# EAGLE board canSlaveV03_16s (EAGLE 6.3), part 1 of 2
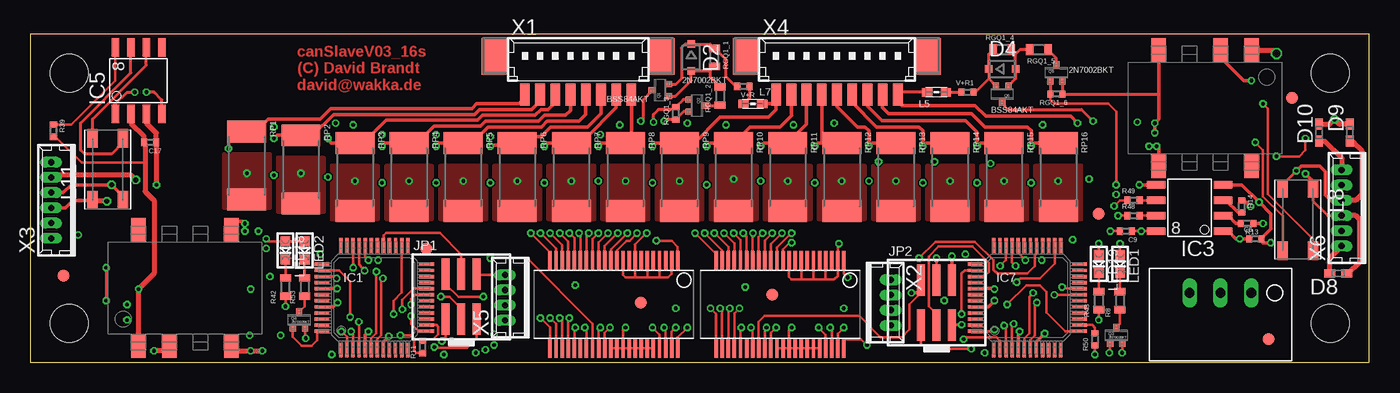
[diagram p6: board, top side]
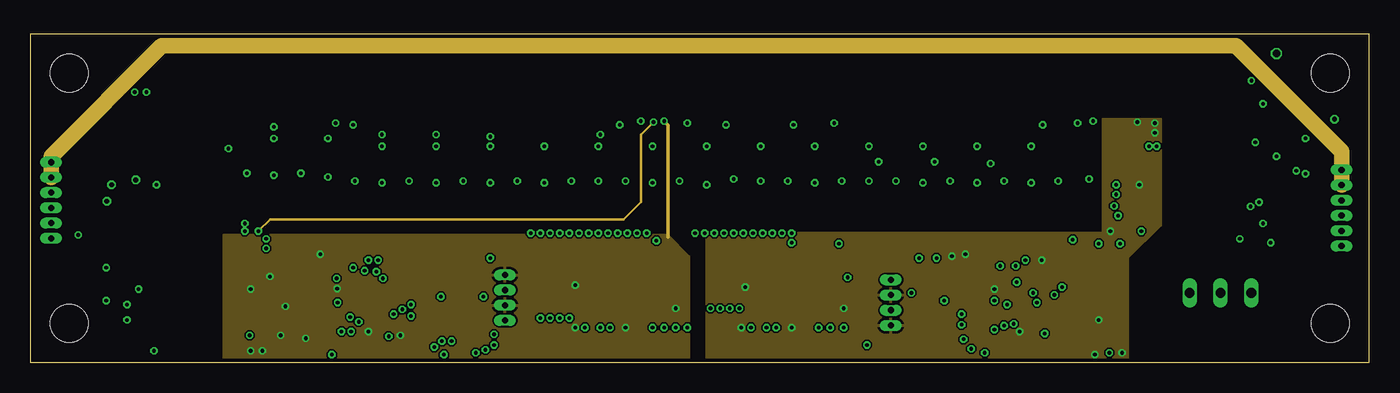
[diagram p7: board, inner layer Route2]
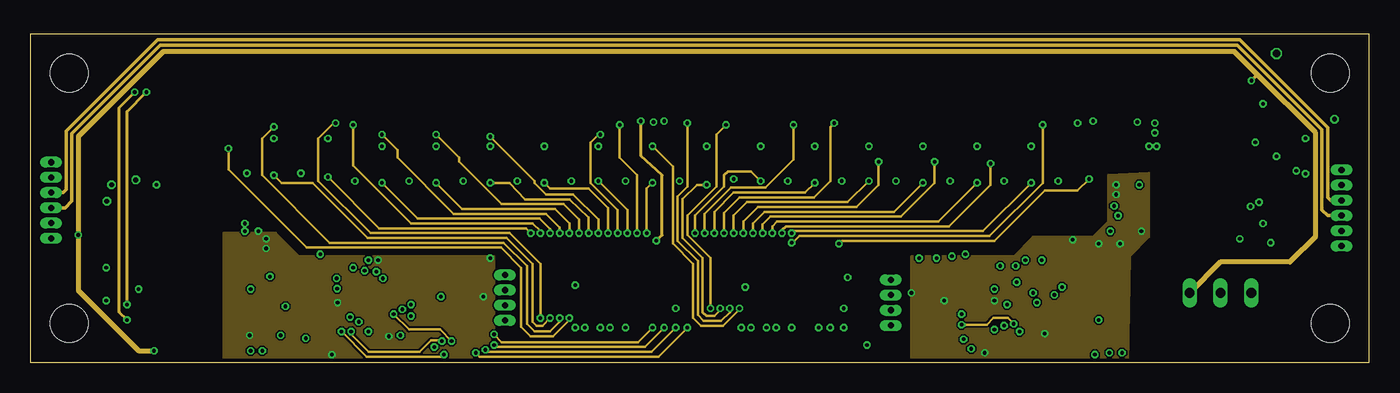
[diagram p8: board, inner layer Route15]
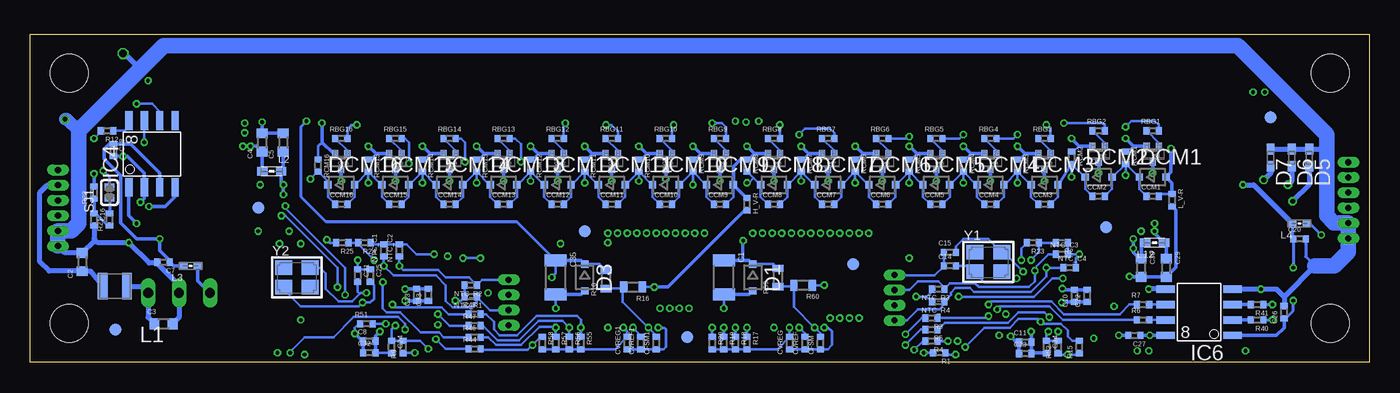
[diagram p9: board, bottom side, seen from below]

Size 110 x 27 mm. Coordinates in mm from the lower left corner, seen from the top.
Outline: 0,0 110,0 110,27 0,27 0,0
Copper layers (1+2*15+16): Top 0.035mm / dielectric 0.38mm / Route2 0.035mm / dielectric 0.71mm / Route15 0.035mm / dielectric 0.38mm / Bottom 0.035mm
Design rules "PCB-POOL Standard_ML4 *": minimum track width 0.15mm, minimum drill 0.3mm, track to track 0.15mm, track to pad 0.15mm, pad to pad 0.15mm, via to via 0.15mm, smd to smd 0.15mm, copper to edge 0.3mm, drill to drill 0.2mm, minimum pad ring 0.2mm, minimum via ring 0.15mm, stop-mask expansion 0.075mm, vias tented up to drill 0.41mm, thermal gap 0.2mm
Holes 3.1 mm at 3.2,3.2 3.2,23.8 106.8,3.2 106.8,23.8
tRestrict: area 0.2,0.2 to 6.2,6.2; area 0.2,20.8 to 6.2,26.8; area 103.8,0.2 to 109.8,6.2; area 103.8,20.8 to 109.8,26.8
bRestrict: area 0.2,0.2 to 6.2,6.2; area 0.2,20.8 to 6.2,26.8; area 103.8,0.2 to 109.8,6.2; area 103.8,20.8 to 109.8,26.8

## Footprints (pad centres in the part's own frame; a part is rotated, then mirrored left to right if it is on the bottom)
C1206 = smd 1 x 1.8: 1 -1.4,0; 2 1.4,0
C0603 = smd 0.8 x 0.9: 1 -0.75,0; 2 0.75,0
C0402 = smd 0.5 x 0.6: 1 -0.5,0; 2 0.5,0
SOD323-R = smd 0.6 x 0.6: A 1.1,0; C -1.1,0
WESURGE_0402 = smd 0.9 x 0.65: 1 -0.7,0; 2 0.7,0
ISF = smd 1.2 x 2: 1 -3.81,-4.75; 2 -1.27,-4.75; 4 3.81,-4.75; 5 3.81,4.75; 8 -3.81,4.75
TSR1 = drill 0.8 long: 1 -2.54,0; 2 0,0; 3 2.54,0
FIDUCIAL_1MM = smd 1 x 1: 1 0,0
R0402 = smd 0.5 x 0.6: 1 -0.5,0; 2 0.5,0
LQFP48 = smd 0.28 x 1.2: 1 -2.75,-4.3; 2 -2.25,-4.3; 3 -1.75,-4.3; 4 -1.25,-4.3; 5 -0.75,-4.3; 6 -0.25,-4.3; 7 0.25,-4.3; 8 0.75,-4.3; 9 1.25,-4.3; 10 1.75,-4.3; 11 2.25,-4.3; 12 2.75,-4.3; 25 2.75,4.3; 26 2.25,4.3; 27 1.75,4.3; 28 1.25,4.3; 29 0.75,4.3; 30 0.25,4.3; 31 -0.25,4.3; 32 -0.75,4.3; 33 -1.25,4.3; 34 -1.75,4.3; 35 -2.25,4.3; 36 -2.75,4.3 | smd 1.2 x 0.28: 13 4.3,-2.75; 14 4.3,-2.25; 15 4.3,-1.75; 16 4.3,-1.25; 17 4.3,-0.75; 18 4.3,-0.25; 19 4.3,0.25; 20 4.3,0.75; 21 4.3,1.25; 22 4.3,1.75; 23 4.3,2.25; 24 4.3,2.75; 37 -4.3,2.75; 38 -4.3,2.25; 39 -4.3,1.75; 40 -4.3,1.25; 41 -4.3,0.75; 42 -4.3,0.25; 43 -4.3,-0.25; 44 -4.3,-0.75; 45 -4.3,-1.25; 46 -4.3,-1.75; 47 -4.3,-2.25; 48 -4.3,-2.75
44SSOP = smd 1.6 x 0.28: 1 -3.6,5.25; 2 -3.6,4.75; 3 -3.6,4.25; 4 -3.6,3.75; 5 -3.6,3.25; 6 -3.6,2.75; 7 -3.6,2.25; 8 -3.6,1.75; 9 -3.6,1.25; 10 -3.6,0.75; 11 -3.6,0.25; 12 -3.6,-0.25; 13 -3.6,-0.75; 14 -3.6,-1.25; 15 -3.6,-1.75; 16 -3.6,-2.25; 17 -3.6,-2.75; 18 -3.6,-3.25; 19 -3.6,-3.75; 20 -3.6,-4.25; 21 -3.6,-4.75; 22 -3.6,-5.25; 23 3.6,-5.25; 24 3.6,-4.75; 25 3.6,-4.25; 26 3.6,-3.75; 27 3.6,-3.25; 28 3.6,-2.75; 29 3.6,-2.25; 30 3.6,-1.75; 31 3.6,-1.25; 32 3.6,-0.75; 33 3.6,-0.25; 34 3.6,0.25; 35 3.6,0.75; 36 3.6,1.25; 37 3.6,1.75; 38 3.6,2.25; 39 3.6,2.75; 40 3.6,3.25; 41 3.6,3.75; 42 3.6,4.25; 43 3.6,4.75; 44 3.6,5.25
SO-8 = smd 1.524 x 0.61: 1 -2.743,1.905; 2 -2.743,0.635; 3 -2.743,-0.635; 4 -2.743,-1.905; 5 2.743,-1.905; 6 2.743,-0.635; 7 2.743,0.635; 8 2.743,1.905
2X03_1.27MM_SMT = smd 0.65 x 2.6: 1 -1.27,-1.85; 2 -1.27,1.85; 3 0,-1.85; 4 0,1.85; 5 1.27,-1.85; 6 1.27,1.85
WE-PMI_1008 = smd 0.8 x 2.2: 1 -1,0; 2 1,0
0603 = smd 0.85 x 0.7: 1 -0.775,0; 2 0.775,0
0402 = smd 0.7 x 0.6: 1 -0.6,0; 2 0.6,0
WE-SL1 = smd 1.5 x 0.85: 1 -2.55,-1.25; 3 -2.55,1.25; 4 2.55,1.25; 5 2.55,-1.25
CHIPLED_0603 = smd 0.8 x 0.8: A 0,-0.75; C 0,0.75
SOT416 = smd 0.5 x 0.6: 1 -0.5,-0.65; 2 0.5,-0.65; 3 0,0.65
R0603 = smd 0.6 x 0.9: 1 -0.75,0; 2 0.75,0
R2512 = smd 1.8 x 3.2: 1 -2.8,0; 2 2.8,0
SOLDERJUMPER_REFLOW_NOPASTE_SMALL = smd 0.584 x 0.762: 1 -0.445,0; 2 0.445,0
53398-08 = smd 0.8 x 1.8: 1 4.375,-2.5; 2 3.125,-2.5; 3 1.875,-2.5; 4 0.625,-2.5; 5 -0.625,-2.5; 6 -1.875,-2.5; 7 -3.125,-2.5; 8 -4.375,-2.5 | smd 2.1 x 3: S1 6.875,0.625; S2 -6.875,0.625
53047-04 = drill 0.5 pad 0.698 long: 1 1.875,0.45; 2 0.625,0.45; 3 -0.625,0.45; 4 -1.875,0.45
53047-06 = drill 0.5 pad 0.698 long: 1 3.125,0.45; 2 1.875,0.45; 3 0.625,0.45; 4 -0.625,0.45; 5 -1.875,0.45; 6 -3.125,0.45
53398-09 = smd 0.8 x 1.8: 1 5,-2.5; 2 3.75,-2.5; 3 2.5,-2.5; 4 1.25,-2.5; 5 0,-2.5; 6 -1.25,-2.5; 7 -2.5,-2.5; 8 -3.75,-2.5; 9 -5,-2.5 | smd 2.1 x 3: S1 7.5,0.625; S2 -7.5,0.625
CRYSTAL_3.2X2.5 = smd 1.4 x 1.2: 1 -1.1,-0.8; 2 1.1,0.8; GND1 -1.1,0.8; GND2 1.1,-0.8

## Placement (x,y rotation side)
C1  10u,50V  [C1206]  53.02,6.99 270 bottom
C2  10u,50V  [C0603]  105.73,8.26 90 bottom
C3  10u,50V  [C0603]  99.06,3.17 0 bottom
C4  10u,50V  [C0603]  90.96,18.1 90 bottom
C5  10u,50V  [C0603]  89.22,18.1 90 bottom
C6  100n  [C0402]  100.65,10.16 0 top
C7  1u  [C0402]  99.06,8.26 180 bottom
C8  10n  [C0402]  82.15,1.75 0 bottom
C9  100n  [C0402]  90.01,10.79 180 top
C10  10n  [C0402]  24.21,5.48 90 bottom
C11  10n  [C0402]  28.26,1.67 0 bottom
C13  10n  [C0402]  78.26,5.56 90 bottom
C14  18p  [C0402]  34.45,7.94 0 bottom
C15  18p  [C0402]  34.45,9.05 0 bottom
C16  4.7n  [C0402]  104.78,11.75 270 bottom
C17  100n  [C0402]  9.84,18.1 180 top
C18  100n  [C0402]  103.19,17.46 270 bottom
C20  1u  [C0402]  5.71,10.16 0 bottom
C22  100n  [C0402]  23.18,5.48 90 bottom
C23  100n  [C0402]  28.26,0.71 0 bottom
C24  100n  [C0402]  80.33,1.27 270 bottom
C25  18p  [C0402]  82.07,7.14 270 bottom
C26  100n  [C0402]  6.99,4.13 90 bottom
C27  100n  [C0402]  19.29,2.22 180 bottom
C29  10u,50V  [C0603]  16.67,7.78 270 bottom
C30  10u,50V  [C0603]  18.73,7.78 270 bottom
C31  18p  [C0402]  83.11,7.14 270 bottom
C32  100n  [C0402]  82.15,0.79 0 bottom
C33  100n  [C0402]  77.31,5.56 90 bottom
C34  100n  [C0402]  26.51,1.27 270 bottom
C35  10u,50V  [C1206]  66.83,6.99 270 bottom
CCM1  100n  [C0402]  17.78,13.65 0 bottom
CCM2  100n  [C0402]  22.23,13.65 0 bottom
CCM3  100n  [C0402]  26.67,13.02 0 bottom
CCM4  100n  [C0402]  31.11,13.02 0 bottom
CCM5  100n  [C0402]  35.56,13.02 0 bottom
CCM6  100n  [C0402]  40.01,13.02 0 bottom
CCM7  100n  [C0402]  44.45,13.02 0 bottom
CCM8  100n  [C0402]  48.9,13.02 0 bottom
CCM9  100n  [C0402]  53.34,13.02 0 bottom
CCM10  100n  [C0402]  57.78,13.02 0 bottom
CCM11  100n  [C0402]  62.23,13.02 0 bottom
CCM12  100n  [C0402]  66.67,13.02 0 bottom
CCM13  100n  [C0402]  71.12,13.02 0 bottom
CCM14  100n  [C0402]  75.56,13.02 0 bottom
CCM15  100n  [C0402]  80.01,13.02 0 bottom
CCM16  100n  [C0402]  84.45,13.02 0 bottom
CFSM  1u  [C0402]  45.09,1.59 90 bottom
CFSM1  1u  [C0402]  58.58,1.59 90 bottom
CVREF  1u  [C0402]  46.35,1.59 90 bottom
CVREF1  1u  [C0402]  59.85,1.59 90 bottom
CVREG  1u  [C0402]  47.62,1.59 90 bottom
CVREG1  1u  [C0402]  60.96,1.59 90 bottom
D1  40V  [SOD323-R]  50.64,6.99 270 bottom
D2  12V  [SOD323-R]  54.29,25.08 270 top
D3  40V  [SOD323-R]  64.45,6.99 270 bottom
D4  12V  [SOD323-R]  79.85,24.13 0 top
D5  WE-VE_0402  [WESURGE_0402]  4.92,16.83 90 bottom
D6  WE-VE_0402  [WESURGE_0402]  6.35,16.83 90 bottom
D7  WE-VE_0402  [WESURGE_0402]  8.1,16.83 90 bottom
D8  WE-VE_0402  [WESURGE_0402]  107.47,7.3 0 top
D9  WE-VE_0402  [WESURGE_0402]  108.43,18.89 270 top
D10  WE-VE_0402  [WESURGE_0402]  105.89,18.89 270 top
DCDC1  TES 1-0510  [ISF]  96.52,20.92 180 top
DCDC2  TES 1-0510  [ISF]  12.7,6.11 0 top
DCIN  TSR 1-2450  [TSR1]  97.79,5.71 180 top
DCM1  7.5  [SOD323-R]  17.78,15.24 0 bottom
DCM2  7.5  [SOD323-R]  22.23,15.24 0 bottom
DCM3  7.5  [SOD323-R]  26.67,14.61 0 bottom
DCM4  7.5  [SOD323-R]  31.11,14.61 0 bottom
DCM5  7.5  [SOD323-R]  35.56,14.61 0 bottom
DCM6  7.5  [SOD323-R]  40.01,14.61 0 bottom
DCM7  7.5  [SOD323-R]  44.45,14.61 0 bottom
DCM8  7.5  [SOD323-R]  48.9,14.61 0 bottom
DCM9  7.5  [SOD323-R]  53.34,14.61 0 bottom
DCM10  7.5  [SOD323-R]  57.78,14.61 0 bottom
DCM11  7.5  [SOD323-R]  62.23,14.61 0 bottom
DCM12  7.5  [SOD323-R]  66.67,14.61 0 bottom
DCM13  7.5  [SOD323-R]  71.12,14.61 0 bottom
DCM14  7.5  [SOD323-R]  75.56,14.61 0 bottom
DCM15  7.5  [SOD323-R]  80.01,14.61 0 bottom
DCM16  7.5  [SOD323-R]  84.45,14.61 0 bottom
FID1  FIDUCIAL""  [FIDUCIAL_1MM]  50.16,4.92 0 top
FID2  FIDUCIAL""  [FIDUCIAL_1MM]  60.96,5.56 0 top
FID3  FIDUCIAL""  [FIDUCIAL_1MM]  2.7,7.14 0 top
FID4  FIDUCIAL""  [FIDUCIAL_1MM]  103.66,21.75 0 top
FID5  FIDUCIAL""  [FIDUCIAL_1MM]  101.76,1.91 0 top
FID6  FIDUCIAL""  [FIDUCIAL_1MM]  87.79,12.22 0 top
FID7  FIDUCIAL""  [FIDUCIAL_1MM]  32.54,9.37 0 top
FID8  FIDUCIAL""  [FIDUCIAL_1MM]  91.28,12.7 0 bottom
FID9  FIDUCIAL""  [FIDUCIAL_1MM]  21.59,11.11 0 bottom
FID10  FIDUCIAL""  [FIDUCIAL_1MM]  8.1,20.16 0 bottom
FID11  FIDUCIAL""  [FIDUCIAL_1MM]  42.39,8.1 0 bottom
FID12  FIDUCIAL""  [FIDUCIAL_1MM]  103.03,2.7 0 bottom
FID13  FIDUCIAL""  [FIDUCIAL_1MM]  64.45,10.79 0 bottom
FID14  FIDUCIAL""  [FIDUCIAL_1MM]  56.04,2.06 0 bottom
H_V-R  100  [R0402]  51.12,13.02 270 bottom
IC1  LPC11C1X  [LQFP48]  28.26,5.32 0 top
IC2  LTC6803-4  [44SSOP]  47.94,4.76 270 top
IC3  ADUM1201  [SO-8]  95.25,12.7 180 top
IC4  MCP2551  [SO-8]  100.01,17.14 90 bottom
IC5  MCP2551  [SO-8]  8.89,23.18 90 top
IC6  ADUM1201  [SO-8]  13.97,4.13 180 bottom
IC7  LPC11C1X  [LQFP48]  81.92,5.32 0 top
IC8  LTC6803-4  [44SSOP]  61.59,4.76 270 top
JP1  [2X03_1.27MM_SMT]  35.4,5.4 0 top
JP2  [2X03_1.27MM_SMT]  74.45,4.92 0 top
L1  WE-PMI_1008  [WE-PMI_1008]  103.07,6.27 180 bottom
L2  WE-CBF_0603  [0603]  90.17,15.72 180 bottom
L3  WE-CBF_0402  [0402]  96.84,7.94 0 bottom
L4  WE-CBF_0402  [0402]  5.71,11.43 0 bottom
L5  WE-CBF_0603  [0603]  74.45,22.23 0 top
L7  WE-CBF_0603  [0603]  59.37,21.27 180 top
L8  744212820  [WE-SL1]  104.14,11.75 270 top
L11  744212820  [WE-SL1]  6.35,15.88 90 top
L12  WE-CBF_0603  [0603]  17.62,9.84 0 bottom
L_V-R  100  [R0402]  16.19,13.34 270 bottom
LED1  O  [CHIPLED_0603]  89.53,8.1 180 top
LED2  O  [CHIPLED_0603]  22.54,9.21 180 top
LED18  G  [CHIPLED_0603]  20.95,9.21 180 top
LED19  G  [CHIPLED_0603]  87.79,8.1 180 top
NTC_C1  100n  [C0402]  80.96,9.21 90 bottom
NTC_C2  100n  [C0402]  79.69,9.21 90 bottom
NTC_C3  100n  [C0402]  25.24,8.89 0 bottom
NTC_C4  100n  [C0402]  24.61,7.78 0 bottom
NTC_R1  1k  [R0402]  73.82,5.4 180 bottom
NTC_R2  1k  [R0402]  73.82,6.35 180 bottom
NTC_R3  1k  [R0402]  35.4,6.03 180 bottom
NTC_R4  1k  [R0402]  35.4,5 180 bottom
Q1  BSS84AKT  [SOT416]  51.75,22.38 90 top
Q2  2N7002BKT  [SOT416]  54.77,21.11 270 top
Q3  2N7002BKT  [SOT416]  89.22,2.22 0 top
Q4  2N7002BKT  [SOT416]  22.07,3.49 0 top
Q5  2N7002BKT  [SOT416]  84.3,23.81 0 top
Q6  BSS84AKT  [SOT416]  79.85,22.07 180 top
QB1  BSS84AKT  [SOT416]  17.78,17.14 180 bottom
QB2  BSS84AKT  [SOT416]  22.23,17.14 180 bottom
QB3  BSS84AKT  [SOT416]  26.67,16.51 180 bottom
QB4  BSS84AKT  [SOT416]  31.11,16.51 180 bottom
QB5  BSS84AKT  [SOT416]  35.56,16.51 180 bottom
QB6  BSS84AKT  [SOT416]  40.01,16.51 180 bottom
QB7  BSS84AKT  [SOT416]  44.45,16.51 180 bottom
QB8  BSS84AKT  [SOT416]  48.9,16.51 180 bottom
QB9  BSS84AKT  [SOT416]  53.34,16.51 180 bottom
QB10  BSS84AKT  [SOT416]  57.78,16.51 180 bottom
QB11  BSS84AKT  [SOT416]  62.23,16.51 180 bottom
QB12  BSS84AKT  [SOT416]  66.67,16.51 180 bottom
QB13  BSS84AKT  [SOT416]  71.12,16.51 180 bottom
QB14  BSS84AKT  [SOT416]  75.56,16.51 180 bottom
QB15  BSS84AKT  [SOT416]  80.01,16.51 180 bottom
QB16  BSS84AKT  [SOT416]  84.45,16.51 180 bottom
R1  100  [R0402]  35.32,0.79 180 bottom
R2  VAR  [R0402]  25.24,9.84 180 bottom
R3  100  [R0402]  35.96,3.65 180 bottom
R4  100  [R0402]  35.96,1.75 180 bottom
R5  100  [R0402]  35.96,2.7 180 bottom
R6  100  [R0402]  18.57,3.49 0 bottom
R7  100  [R0402]  18.57,4.76 0 bottom
R8  1k  [R0603]  89.53,5.08 90 top
R9  10k  [R0402]  79.38,1.27 90 bottom
R10  330k  [R0603]  62.71,6.83 90 bottom
R11  10k  [R0402]  32.23,1.27 90 top
R12  1.5k  [R0402]  103.7,19.05 180 bottom
R13  100  [R0402]  99.97,11.43 180 top
R14  100  [R0402]  99.54,12.82 270 top
R15  10k  [R0402]  23.81,1.27 90 bottom
R16  22k  [R0603]  60.48,6.19 180 bottom
R17  1M  [R0402]  51.12,1.59 270 bottom
R18  1M  [R0402]  52.07,1.59 270 bottom
R19  4.7k  [R0402]  53.02,1.59 270 bottom
R20  1M  [R0402]  53.98,1.59 270 bottom
R21  60  [R0402]  103.5,11.75 90 bottom
R22  60  [R0402]  104.78,13.97 90 bottom
R23  VAR  [R0402]  27.62,9.84 180 bottom
R24  VAR  [R0402]  82.55,9.84 180 bottom
R25  VAR  [R0402]  84.38,9.84 180 bottom
R39  1.5k  [R0402]  1.91,19.05 270 top
R40  100  [R0402]  9.21,3.49 180 bottom
R41  100  [R0402]  9.21,4.76 180 bottom
R42  1k  [R0603]  20.95,6.19 90 top
R43  1k  [R0603]  87.79,5.08 90 top
R44  100  [R0402]  73.5,1.11 0 bottom
R45  100  [R0402]  73.5,3.97 0 bottom
R46  100  [R0402]  73.5,2.06 0 bottom
R47  100  [R0402]  73.5,3.02 0 bottom
R48  100  [R0402]  90.65,12.06 0 top
R49  100  [R0402]  90.65,13.34 0 top
R50  10k  [R0402]  87.47,1.91 90 top
R51  10k  [R0402]  82.39,3.17 0 bottom
R52  10k  [R0402]  25.56,1.27 90 bottom
R53  1k  [R0603]  22.54,6.19 90 top
R55  1M  [R0402]  64.77,1.59 270 bottom
R56  1M  [R0402]  65.72,1.59 270 bottom
R57  4.7k  [R0402]  66.83,1.59 270 bottom
R58  1M  [R0402]  67.94,1.59 270 bottom
R59  330k  [R0603]  48.58,6.99 90 bottom
R60  22k  [R0603]  46.51,6.35 180 bottom
RBG1  3.3k  [R0402]  17.78,19.05 0 bottom
RBG2  3.3k  [R0402]  22.23,19.05 0 bottom
RBG3  3.3k  [R0402]  26.67,18.41 0 bottom
RBG4  3.3k  [R0402]  31.11,18.41 0 bottom
RBG5  3.3k  [R0402]  35.56,18.41 0 bottom
RBG6  3.3k  [R0402]  40.01,18.41 0 bottom
RBG7  3.3k  [R0402]  44.45,18.41 0 bottom
RBG8  3.3k  [R0402]  48.9,18.41 0 bottom
RBG9  3.3k  [R0402]  53.34,18.41 0 bottom
RBG10  3.3k  [R0402]  57.78,18.41 0 bottom
RBG11  3.3k  [R0402]  62.23,18.41 0 bottom
RBG12  3.3k  [R0402]  66.67,18.41 0 bottom
RBG13  3.3k  [R0402]  71.12,18.41 0 bottom
RBG14  3.3k  [R0402]  75.56,18.41 0 bottom
RBG15  3.3k  [R0402]  80.01,18.41 0 bottom
RBG16  3.3k  [R0402]  84.45,18.41 0 bottom
RCM1  100  [R0402]  20,16.83 270 bottom
RCM2  100  [R0402]  24.45,16.83 270 bottom
RCM3  100  [R0402]  28.89,16.19 270 bottom
RCM4  100  [R0402]  33.34,16.19 270 bottom
RCM5  100  [R0402]  37.78,16.19 270 bottom
RCM6  100  [R0402]  42.23,16.19 270 bottom
RCM7  100  [R0402]  46.67,16.19 270 bottom
RCM8  100  [R0402]  51.12,16.19 270 bottom
RCM9  100  [R0402]  55.56,16.19 270 bottom
RCM10  100  [R0402]  60.01,16.19 270 bottom
RCM11  100  [R0402]  64.45,16.19 270 bottom
RCM12  100  [R0402]  68.9,16.19 270 bottom
RCM13  100  [R0402]  73.34,16.19 270 bottom
RCM14  100  [R0402]  77.79,16.19 270 bottom
RCM15  100  [R0402]  82.23,16.19 270 bottom
RCM16  100  [R0402]  86.36,16.19 270 bottom
RGQ1_1  1M,50V  [R0603]  56.2,25.08 270 top
RGQ1_2  100k,50V  [R0603]  56.67,21.91 90 top
RGQ1_3  1M  [R0402]  53.02,20.48 90 top
RGQ1_4  1M,50V  [R0603]  79.85,25.72 0 top
RGQ1_5  100k,50V  [R0603]  82.87,25.72 180 top
RGQ1_6  1M  [R0402]  84.3,22.07 180 top
RP1  100  [R2512]  17.78,16.19 270 top
RP2  100  [R2512]  22.23,15.88 270 top
RP3  100  [R2512]  26.67,15.24 270 top
RP4  100  [R2512]  31.11,15.24 270 top
RP5  100  [R2512]  35.56,15.24 270 top
RP6  100  [R2512]  40.01,15.24 270 top
RP7  100  [R2512]  44.45,15.24 270 top
RP8  100  [R2512]  48.9,15.24 270 top
RP9  100  [R2512]  53.34,15.24 270 top
RP10  100  [R2512]  57.78,15.24 270 top
RP11  100  [R2512]  62.23,15.24 270 top
RP12  100  [R2512]  66.67,15.24 270 top
RP13  100  [R2512]  71.12,15.24 270 top
RP14  100  [R2512]  75.56,15.24 270 top
RP15  100  [R2512]  80.01,15.24 270 top
RP16  100  [R2512]  84.45,15.24 270 top
SJ1  [SOLDERJUMPER_REFLOW_NOPASTE_SMALL]  103.5,13.97 90 bottom
V+R  100  [R0402]  58.58,22.7 180 top
V+R1  100  [R0402]  76.99,22.23 0 top
X1  53398-08  [53398-08]  45.01,24.53 0 top
X2  53047-04  [53047-04]  70.25,4.92 270 top
X3  53047-06  [53047-06]  2.14,13.34 90 top
X4  53398-09  [53398-09]  66.28,24.53 0 top
X5  53047-04  [53047-04]  39.45,5.32 90 top
X6  53047-06  [53047-06]  108.19,12.7 90 top
Y1  12M  [CRYSTAL_3.2X2.5]  31.27,8.26 0 bottom
Y2  12M  [CRYSTAL_3.2X2.5]  88.11,6.99 0 bottom